# EAGLE design my (EAGLE 9.5.0)

## Sheet 1 of 2
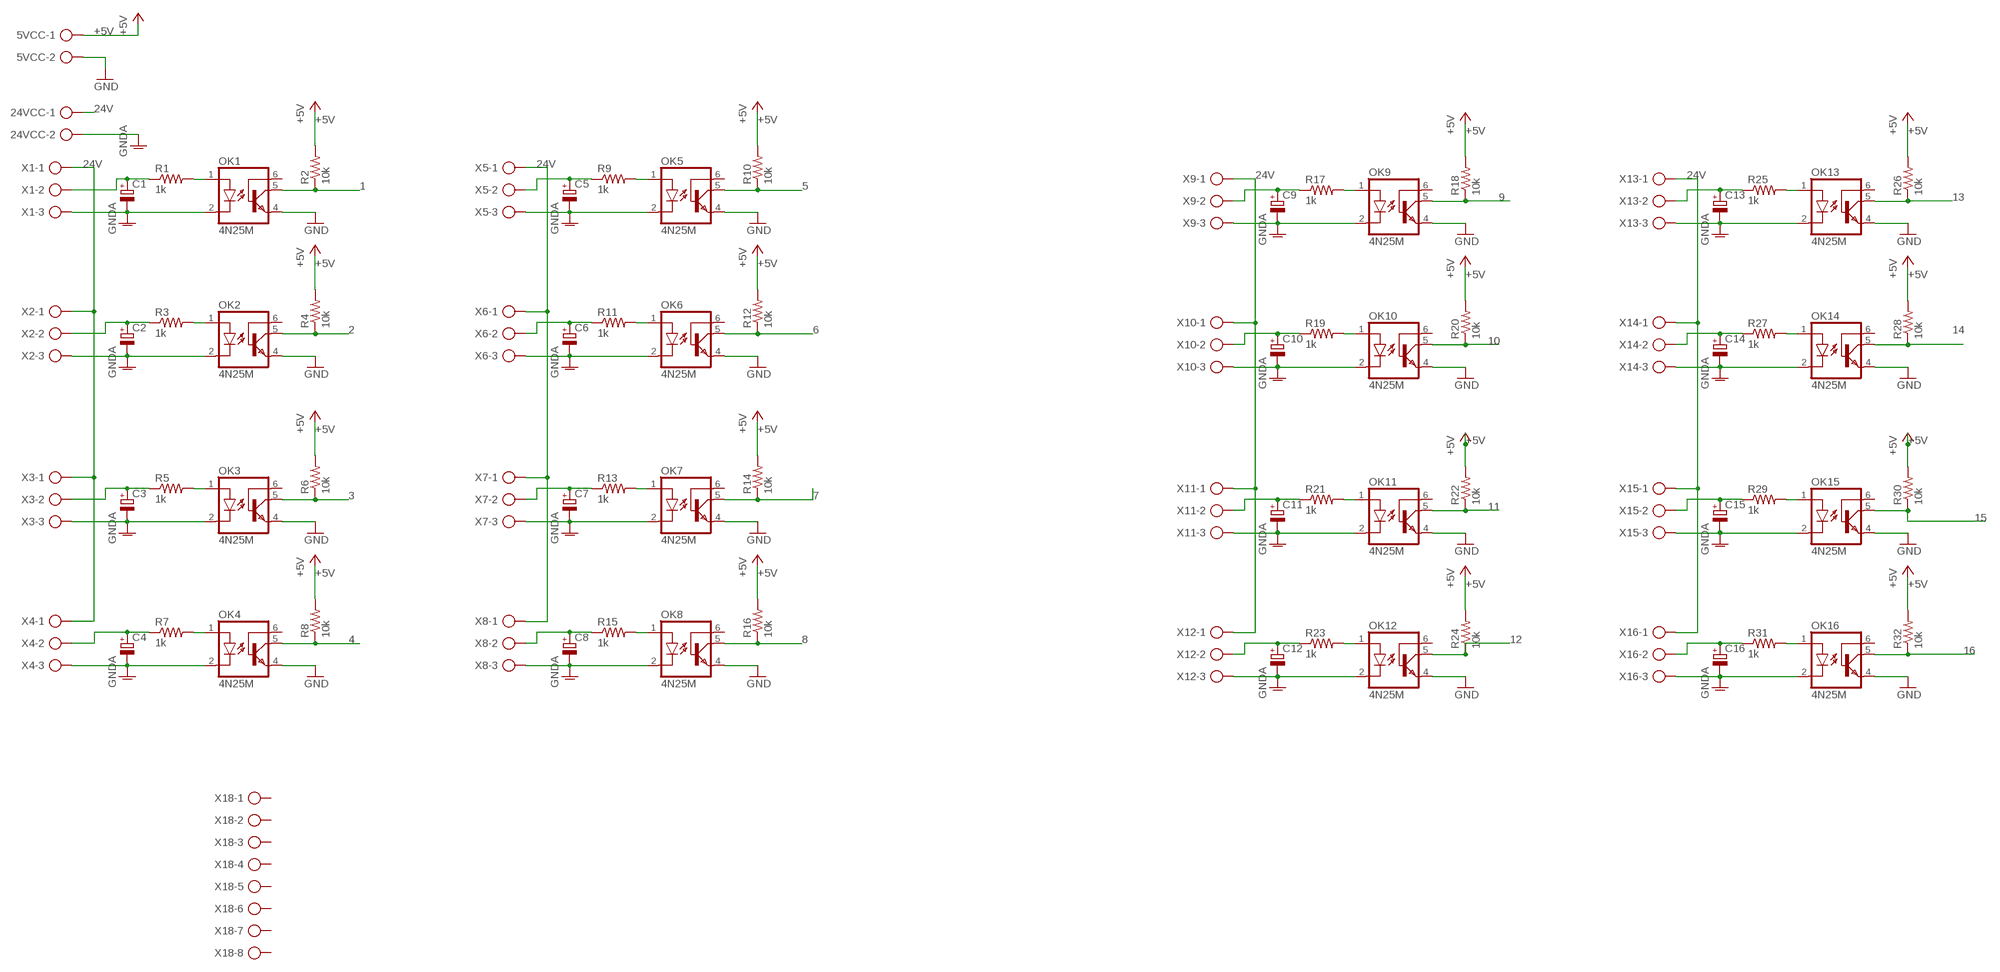
[diagram p0: schematic, sheet 1]

### Parts
5VCC  AK300/2  [AK300/2]
24VCC  AK300/2  [AK300/2]
C1  CPOL-EUE2.5-5  [E2,5-5]
C2  CPOL-EUE2.5-5  [E2,5-5]
C3  CPOL-EUE2.5-5  [E2,5-5]
C4  CPOL-EUE2.5-5  [E2,5-5]
C5  CPOL-EUE2.5-5  [E2,5-5]
C6  CPOL-EUE2.5-5  [E2,5-5]
C7  CPOL-EUE2.5-5  [E2,5-5]
C8  CPOL-EUE2.5-5  [E2,5-5]
C9  CPOL-EUE2.5-5  [E2,5-5]
C10  CPOL-EUE2.5-5  [E2,5-5]
C11  CPOL-EUE2.5-5  [E2,5-5]
C12  CPOL-EUE2.5-5  [E2,5-5]
C13  CPOL-EUE2.5-5  [E2,5-5]
C14  CPOL-EUE2.5-5  [E2,5-5]
C15  CPOL-EUE2.5-5  [E2,5-5]
C16  CPOL-EUE2.5-5  [E2,5-5]
OK1  4N25M  [DIL06]
OK2  4N25M  [DIL06]
OK3  4N25M  [DIL06]
OK4  4N25M  [DIL06]
OK5  4N25M  [DIL06]
OK6  4N25M  [DIL06]
OK7  4N25M  [DIL06]
OK8  4N25M  [DIL06]
OK9  4N25M  [DIL06]
OK10  4N25M  [DIL06]
OK11  4N25M  [DIL06]
OK12  4N25M  [DIL06]
OK13  4N25M  [DIL06]
OK14  4N25M  [DIL06]
OK15  4N25M  [DIL06]
OK16  4N25M  [DIL06]
R1  1k  R-US_0207/10  [0207/10]
R2  10k  R-US_0207/10  [0207/10]
R3  1k  R-US_0207/10  [0207/10]
R4  10k  R-US_0207/10  [0207/10]
R5  1k  R-US_0207/10  [0207/10]
R6  10k  R-US_0207/10  [0207/10]
R7  1k  R-US_0207/10  [0207/10]
R8  10k  R-US_0207/10  [0207/10]
R9  1k  R-US_0207/10  [0207/10]
R10  10k  R-US_0207/10  [0207/10]
R11  1k  R-US_0207/10  [0207/10]
R12  10k  R-US_0207/10  [0207/10]
R13  1k  R-US_0207/10  [0207/10]
R14  10k  R-US_0207/10  [0207/10]
R15  1k  R-US_0207/10  [0207/10]
R16  10k  R-US_0207/10  [0207/10]
R17  1k  R-US_0207/10  [0207/10]
R18  10k  R-US_0207/10  [0207/10]
R19  1k  R-US_0207/10  [0207/10]
R20  10k  R-US_0207/10  [0207/10]
R21  1k  R-US_0207/10  [0207/10]
R22  10k  R-US_0207/10  [0207/10]
R23  1k  R-US_0207/10  [0207/10]
R24  10k  R-US_0207/10  [0207/10]
R25  1k  R-US_0207/10  [0207/10]
R26  10k  R-US_0207/10  [0207/10]
R27  1k  R-US_0207/10  [0207/10]
R28  10k  R-US_0207/10  [0207/10]
R29  1k  R-US_0207/10  [0207/10]
R30  10k  R-US_0207/10  [0207/10]
R31  1k  R-US_0207/10  [0207/10]
R32  10k  R-US_0207/10  [0207/10]
X1  AK300/3  [AK300/3]
X2  AK300/3  [AK300/3]
X3  AK300/3  [AK300/3]
X4  AK300/3  [AK300/3]
X5  AK300/3  [AK300/3]
X6  AK300/3  [AK300/3]
X7  AK300/3  [AK300/3]
X8  AK300/3  [AK300/3]
X9  AK300/3  [AK300/3]
X10  AK300/3  [AK300/3]
X11  AK300/3  [AK300/3]
X12  AK300/3  [AK300/3]
X13  AK300/3  [AK300/3]
X14  AK300/3  [AK300/3]
X15  AK300/3  [AK300/3]
X16  AK300/3  [AK300/3]
X18  AK300/8  [AK300/8]

### Nets
1: OK1.5(COL) R2.1 ; also sheet 2
2: OK2.5(COL) R4.1 ; also sheet 2
3: OK3.5(COL) R6.1 ; also sheet 2
4: OK4.5(COL) R8.1 ; also sheet 2
5: OK5.5(COL) R10.1 ; also sheet 2
6: OK6.5(COL) R12.1 ; also sheet 2
7: OK7.5(COL) R14.1 ; also sheet 2
8: OK8.5(COL) R16.1 ; also sheet 2
9: OK9.5(COL) R18.1 ; also sheet 2
10: OK10.5(COL) R20.1 ; also sheet 2
11: OK11.5(COL) R22.1 ; also sheet 2
12: OK12.5(COL) R24.1 ; also sheet 2
13: OK13.5(COL) R26.1 ; also sheet 2
14: OK14.5(COL) R28.1 ; also sheet 2
15: OK15.5(COL) R30.1 ; also sheet 2
16: OK16.5(COL) R32.1 ; also sheet 2
24V: 24VCC.1 X1.1 X2.1 X3.1 X4.1 X5.1 X6.1 X7.1 X8.1 X9.1 X10.1 X11.1 X12.1 X13.1 X14.1 X15.1 X16.1
+5V: 5VCC.1 R2.2 R4.2 R6.2 R8.2 R10.2 R12.2 R14.2 R16.2 R18.2 R20.2 R22.2 R24.2 R26.2 R28.2 R30.2 R32.2 ; also sheet 2
GND: 5VCC.2 OK1.4(EMI) OK2.4(EMI) OK3.4(EMI) OK4.4(EMI) OK5.4(EMI) OK6.4(EMI) OK7.4(EMI) OK8.4(EMI) OK9.4(EMI) OK10.4(EMI) OK11.4(EMI) OK12.4(EMI) OK13.4(EMI) OK14.4(EMI) OK15.4(EMI) OK16.4(EMI) ; also sheet 2
GNDA: 24VCC.2 C1.- C2.- C3.- C4.- C5.- C6.- C7.- C8.- C9.- C10.- C11.- C12.- C13.- C14.- C15.- C16.- OK1.2(C) OK2.2(C) OK3.2(C) OK4.2(C) OK5.2(C) OK6.2(C) OK7.2(C) OK8.2(C) OK9.2(C) OK10.2(C) OK11.2(C) OK12.2(C) OK13.2(C) OK14.2(C) OK15.2(C) OK16.2(C) X1.3 X2.3 X3.3 X4.3 X5.3 X6.3 X7.3 X8.3 X9.3 X10.3 X11.3 X12.3 X13.3 X14.3 X15.3 X16.3
N$1: OK1.1(A) R1.2
N$2: OK2.1(A) R3.2
N$3: C2.+ R3.1 X2.2
N$5: OK3.1(A) R5.2
N$6: C3.+ R5.1 X3.2
N$8: OK4.1(A) R7.2
N$9: C4.+ R7.1 X4.2
N$11: OK5.1(A) R9.2
N$12: C5.+ R9.1 X5.2
N$14: OK6.1(A) R11.2
N$15: C1.+ R1.1 X1.2
N$16: C6.+ R11.1 X6.2
N$19: OK7.1(A) R13.2
N$20: C7.+ R13.1 X7.2
N$22: OK8.1(A) R15.2
N$23: C8.+ R15.1 X8.2
N$25: OK9.1(A) R17.2
N$26: C9.+ R17.1 X9.2
N$28: OK10.1(A) R19.2
N$29: C10.+ R19.1 X10.2
N$31: OK11.1(A) R21.2
N$32: C11.+ R21.1 X11.2
N$34: OK12.1(A) R23.2
N$35: C12.+ R23.1 X12.2
N$37: OK13.1(A) R25.2
N$38: C13.+ R25.1 X13.2
N$40: OK14.1(A) R27.2
N$41: C14.+ R27.1 X14.2
N$43: OK15.1(A) R29.2
N$44: C15.+ R29.1 X15.2
N$46: OK16.1(A) R31.2
N$47: C16.+ R31.1 X16.2
Unconnected: OK1.6(BAS) OK2.6(BAS) OK3.6(BAS) OK4.6(BAS) OK5.6(BAS) OK6.6(BAS) OK7.6(BAS) OK8.6(BAS) OK9.6(BAS) OK10.6(BAS) OK11.6(BAS) OK12.6(BAS) OK13.6(BAS) OK14.6(BAS) OK15.6(BAS) OK16.6(BAS) X18.1 X18.2 X18.3 X18.4 X18.5 X18.6 X18.7 X18.8

## Sheet 2 of 2
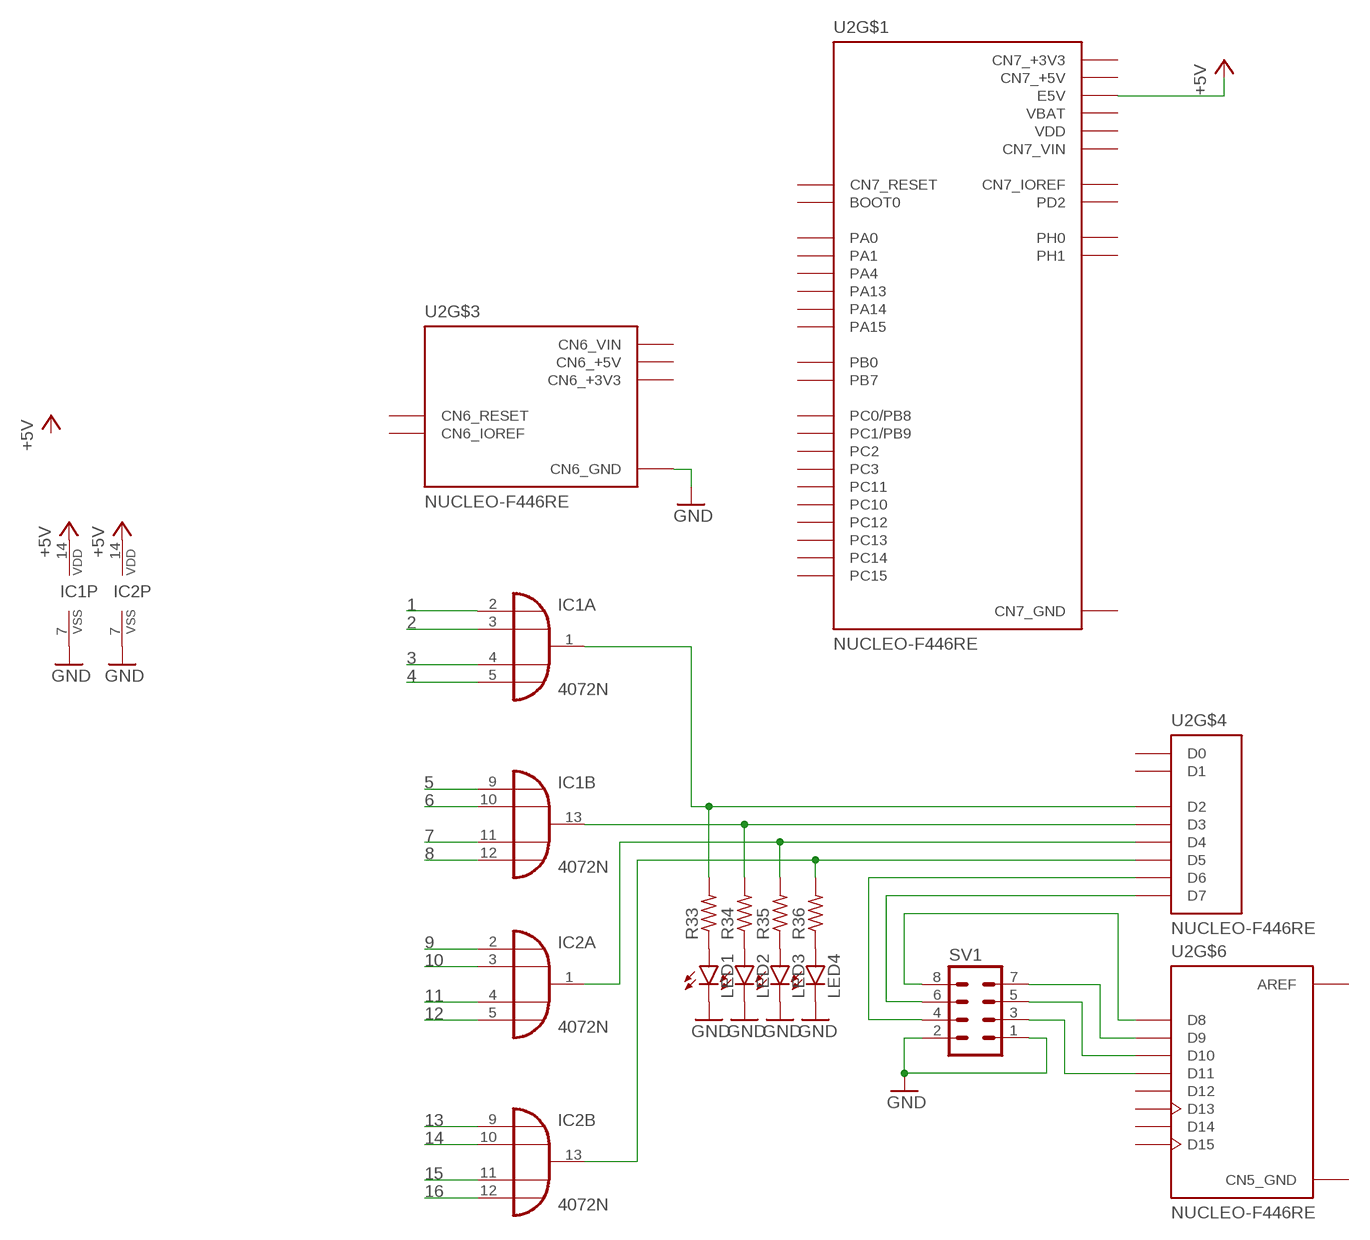
[diagram p1: schematic, sheet 2]

### Parts
IC1  4072N  [DIL14]
IC2  4072N  [DIL14]
LED1  LED3MM  [LED3MM]
LED2  LED3MM  [LED3MM]
LED3  LED3MM  [LED3MM]
LED4  LED3MM  [LED3MM]
R33  R-US_0207/10  [0207/10]
R34  R-US_0207/10  [0207/10]
R35  R-US_0207/10  [0207/10]
R36  R-US_0207/10  [0207/10]
SV1  MA04-2  [MA04-2]
U2  NUCLEO-F446RE  [MODULE_NUCLEO-F446RE]

### Nets
1: IC1.2(A:I0) ; also sheet 1
2: IC1.3(A:I1) ; also sheet 1
3: IC1.4(A:I2) ; also sheet 1
4: IC1.5(A:I3) ; also sheet 1
5: IC1.9(B:I0) ; also sheet 1
6: IC1.10(B:I1) ; also sheet 1
7: IC1.11(B:I2) ; also sheet 1
8: IC1.12(B:I3) ; also sheet 1
9: IC2.2(A:I0) ; also sheet 1
10: IC2.3(A:I1) ; also sheet 1
11: IC2.4(A:I2) ; also sheet 1
12: IC2.5(A:I3) ; also sheet 1
13: IC2.9(B:I0) ; also sheet 1
14: IC2.10(B:I1) ; also sheet 1
15: IC2.11(B:I2) ; also sheet 1
16: IC2.12(B:I3) ; also sheet 1
+5V: IC1.14(P:VDD) IC2.14(P:VDD) U2.CN7_6(E5V) ; also sheet 1
GND: IC1.7(P:VSS) IC2.7(P:VSS) LED1.K(C) LED2.K(C) LED3.K(C) LED4.K(C) SV1.1 SV1.2 U2.CN6_6(CN6_GND) U2.CN6_7(CN6_GND) ; also sheet 1
N$4: IC1.1(A:O) R33.2 U2.CN9_3(D2)
N$7: IC1.13(B:O) R34.2 U2.CN9_4(D3)
N$10: IC2.1(A:O) R35.2 U2.CN9_5(D4)
N$13: IC2.13(B:O) R36.2 U2.CN9_6(D5)
N$17: SV1.3 U2.CN5_4(D11)
N$18: SV1.4 U2.CN9_7(D6)
N$21: SV1.6 U2.CN9_8(D7)
N$24: SV1.8 U2.CN5_1(D8)
N$27: SV1.7 U2.CN5_2(D9)
N$30: SV1.5 U2.CN5_3(D10)
N$36: LED1.A R33.1
N$39: LED2.A R34.1
N$42: LED3.A R35.1
N$45: LED4.A R36.1
Unconnected: U2.CN5_5(D12) U2.CN5_6(D13) U2.CN5_9(D14) U2.CN5_10(D15) U2.CN6_2(CN6_IOREF) U2.CN6_3(CN6_RESET) U2.CN7_1(PC10) U2.CN7_2(PC11) U2.CN7_3(PC12) U2.CN7_4(PD2) U2.CN7_7(BOOT0) U2.CN7_12(CN7_IOREF) U2.CN7_13(PA13) U2.CN7_14(CN7_RESET) U2.CN7_15(PA14) U2.CN7_17(PA15) U2.CN7_21(PB7) U2.CN7_23(PC13) U2.CN7_25(PC14) U2.CN7_27(PC15) U2.CN7_28(PA0) U2.CN7_29(PH0) U2.CN7_30(PA1) U2.CN7_31(PH1) U2.CN7_32(PA4) U2.CN7_34(PB0) U2.CN7_35(PC2) U2.CN7_36(PC1/PB9) U2.CN7_37(PC3) U2.CN7_38(PC0/PB8) U2.CN8_1(A0) U2.CN8_2(A1) U2.CN8_3(A2) U2.CN8_4(A3) U2.CN8_5(A4) U2.CN8_6(A5) U2.CN9_1(D0) U2.CN9_2(D1) U2.CN10_1(PC9) U2.CN10_2(PC8) U2.CN10_3(PB8) U2.CN10_4(PC6) U2.CN10_5(PB9) U2.CN10_6(PC5) U2.CN10_11(PA5) U2.CN10_12(PA12) U2.CN10_13(PA6) U2.CN10_14(PA11) U2.CN10_15(PA7) U2.CN10_16(PB12) U2.CN10_17(PB6) U2.CN10_19(PC7) U2.CN10_21(PA9) U2.CN10_22(PB2) U2.CN10_23(PA8) U2.CN10_24(PB1) U2.CN10_25(PB10) U2.CN10_26(PB15) U2.CN10_27(PB4) U2.CN10_28(PB14) U2.CN10_29(PB5) U2.CN10_30(PB13) U2.CN10_31(PB3) U2.CN10_33(PA10) U2.CN10_34(PC4) U2.CN10_35(PA2) U2.CN10_37(PA3)

## Power pins joined to a net without a drawn wire
AGND: U2.CN10_32(AGND)
AREF: U2.CN5_8(AREF)
AVDD: U2.CN10_7(AVDD)
CN5_GND: U2.CN5_7(CN5_GND)
CN6_+3V3: U2.CN6_4(CN6_+3V3)
CN6_+5V: U2.CN6_5(CN6_+5V)
CN6_VIN: U2.CN6_8(CN6_VIN)
CN7_+3V3: U2.CN7_16(CN7_+3V3)
CN7_+5V: U2.CN7_18(CN7_+5V)
CN7_GND: U2.CN7_8(CN7_GND) U2.CN7_19(CN7_GND) U2.CN7_20(CN7_GND) U2.CN7_22(CN7_GND)
CN7_VIN: U2.CN7_24(CN7_VIN)
CN10_GND: U2.CN10_9(CN10_GND) U2.CN10_20(CN10_GND)
U5V: U2.CN10_8(U5V)
VBAT: U2.CN7_33(VBAT)
VDD: U2.CN7_5(VDD)

## Library data of the parts
5VCC 24VCC = con-ptr500:AK300/2: CONNECTOR; OC_FARNELL: unknown; OC_NEWARK: unknown
C1-C16 = rcl:CPOL-EU: POLARIZED CAPACITOR, European symbol; SPICEPREFIX: C
IC1 IC2 = 40xx:4072: Dual 4-input OR
LED1-LED4 = led:LED: LED OSRAM: - CHIPLED LG R971, LG N971, LY N971, LG Q971, LY Q971, LO R971, LY R971 LH N974, LH R974 LS Q976, LO Q976, LY Q976 LO Q996 - Hyper CHIPLED LW Q18S LB Q993, LB Q99A, LB R99A - SideLED LS A670, LO A670, LY A670, LG A670, LP A670 LB A673, LV A673, LT A673, LW A673 LH A674 LY A675 LS A676, LA A676, LO A676, LY A676, LW A676 LS A679, LY A679, LG A679 - Hyper Micro SIDELED® LS Y876, LA Y876, LO Y876, LY Y876 LT Y87S - SmartLED LW L88C, LW L88S LB L89C, LB L89S, LG L890 LS L89K, LO L89K, LY L89K LS L896, LA L896, LO L896, LY L896 - TOPLED LS T670, LO T670, LY T670, LG T670, LP T670 LSG T670, LSP T670, LSY T670, LOP T670, LYG T670 LG T671, LOG T671, LSG T671 LB T673, LV T673, LT T673, LW T673 LH T674 LS T676, LA T676, LO T676, LY T676, LB T676, LH T676, LSB T676, LW T676 LB T67C, LV T67C, LT T67C, LS T67K, LO T67K, LY T67K, LW E67C LS E67B, LA E67B, LO E67B, LY E67B, LB E67C, LV E67C, LT E67C LW T67C LS T679, LY T679, LG T679 LS T770, LO T770, LY T770, LG T770, LP T770 LB T773, LV T773, LT T773, LW T773 LH T774 LS E675, LA E675, LY E675, LS T675 LS T776, LA T776, LO T776, LY T776, LB T776 LHGB T686 LT T68C, LB T68C - Hyper Mini TOPLED® LB M676 - Mini TOPLED Santana® LG M470 LS M47K, LO M47K, LY M47K Source: http://www.osram.convergy.de LUXEON: - LUMILED® LXK2-PW12-R00, LXK2-PW12-S00, LXK2-PW14-U00, LXK2-PW14-V00 LXK2-PM12-R00, LXK2-PM12-S00, LXK2-PM14-U00 LXK2-PE12-Q00, LXK2-PE12-R00, LXK2-PE12-S00, LXK2-PE14-T00, LXK2-PE14-U00 LXK2-PB12-K00, LXK2-PB12-L00, LXK2-PB12-M00, LXK2-PB14-N00, LXK2-PB14-P00, LXK2-PB14-Q00 LXK2-PR12-L00, LXK2-PR12-M00, LXK2-PR14-Q00, LXK2-PR14-R00 LXK2-PD12-Q00, LXK2-PD12-R00, LXK2-PD12-S00 LXK2-PH12-R00, LXK2-PH12-S00 LXK2-PL12-P00, LXK2-PL12-Q00, LXK2-PL12-R00 Source: www.luxeon.com KINGBRIGHT: KA-3528ASYC Source: www.kingbright.com
OK1-OK16 = optocoupler:4N*?M: General Purpose 6-Pin Phototransistor Optocouplers Source: http://www.fairchildsemi.com/ds/4N/4N35-M.pdf; MPN: 4N25-M; OC_FARNELL: 1021349; OC_NEWARK: 98K9084
R1-R36 = rcl:R-US_: RESISTOR, American symbol; SPICEPREFIX: R
SV1 = con-lstb:MA04-2: PIN HEADER; OC_FARNELL: unknown; OC_NEWARK: unknown
U2 = NUCLEO-F446RE:NUCLEO-F446RE: STM32 Nucleo-64 development board with STM32F446RET6 MCU, supports Arduino and ST morpho connectivity Check prices <https://pricing.snapeda.com/parts/NUCLEO-F446RE/STMicroelectronics/view-part?ref=eda>; AVAILABILITY: Warning; DESCRIPTION: STM32F446RE, mbed-Enabled Development Nucleo-64 STM32F4 ARM® Cortex®-M4 MCU 32-Bit Embedded Evaluation Board; MF: STMicroelectronics; MP: NUCLEO-F446RE; PACKAGE: None; PRICE: None; PURCHASE-URL: https://pricing.snapeda.com/search/part/NUCLEO-F446RE/?ref=eda
X1-X16 = con-ptr500:AK300/3: CONNECTOR; OC_FARNELL: unknown; OC_NEWARK: unknown
X18 = con-ptr500:AK300/8: CONNECTOR; OC_FARNELL: unknown; OC_NEWARK: unknown

## Board
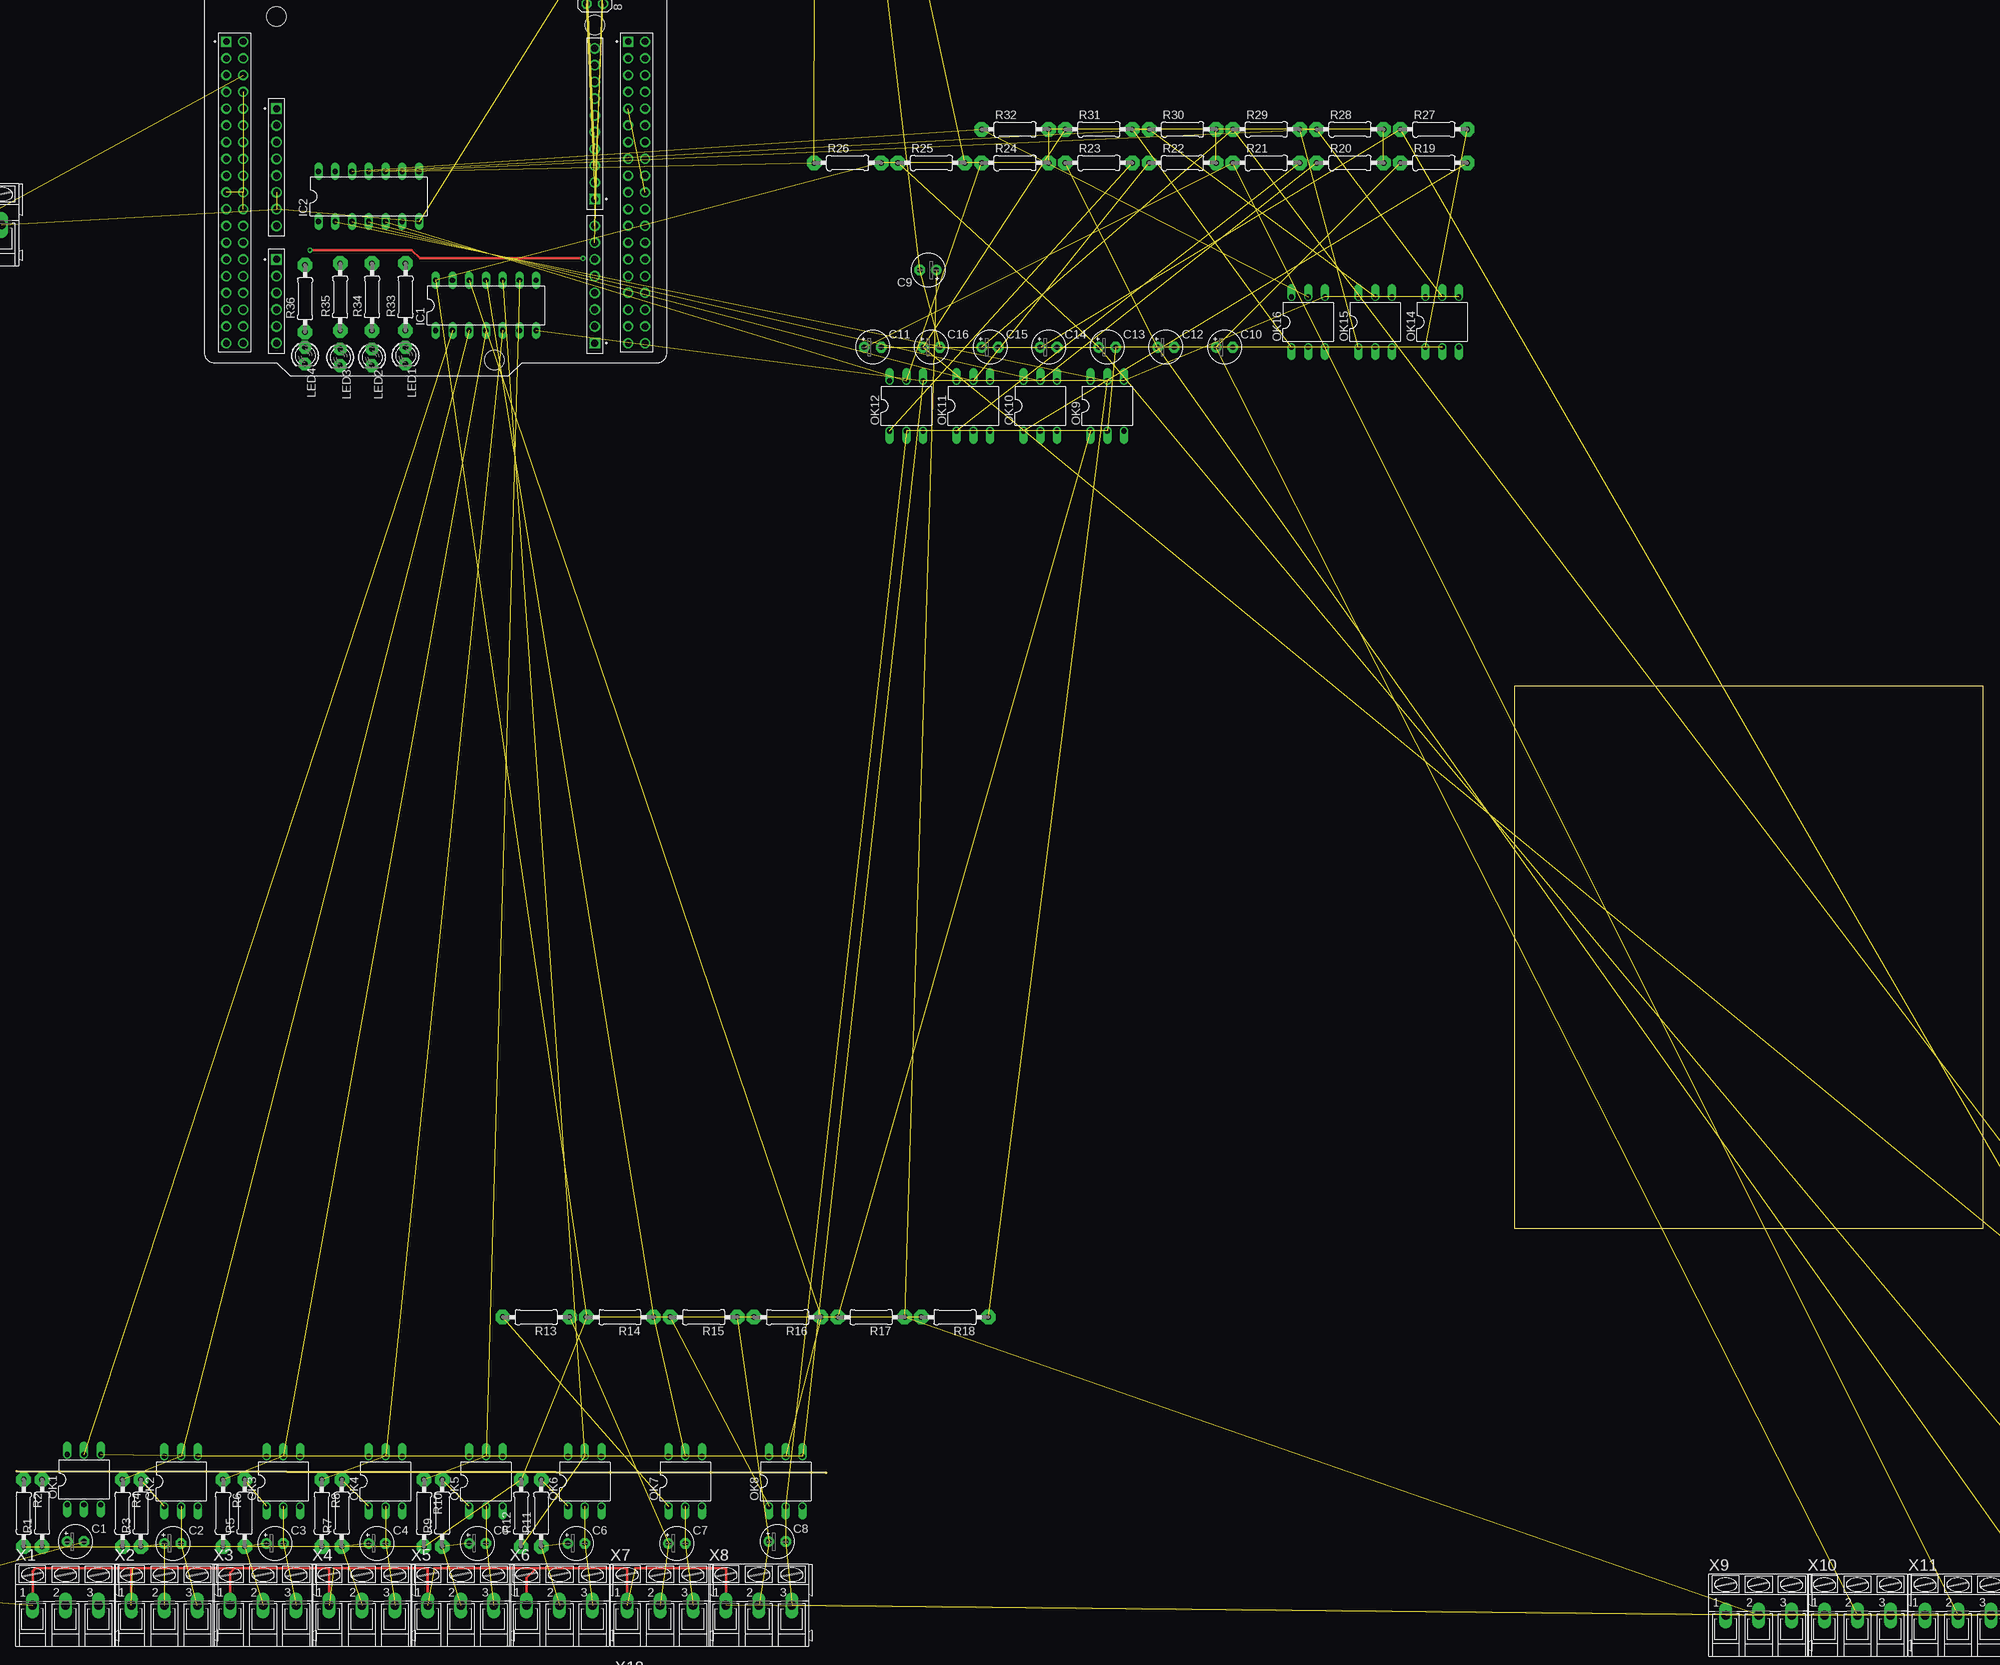
[diagram p2: board, top side]
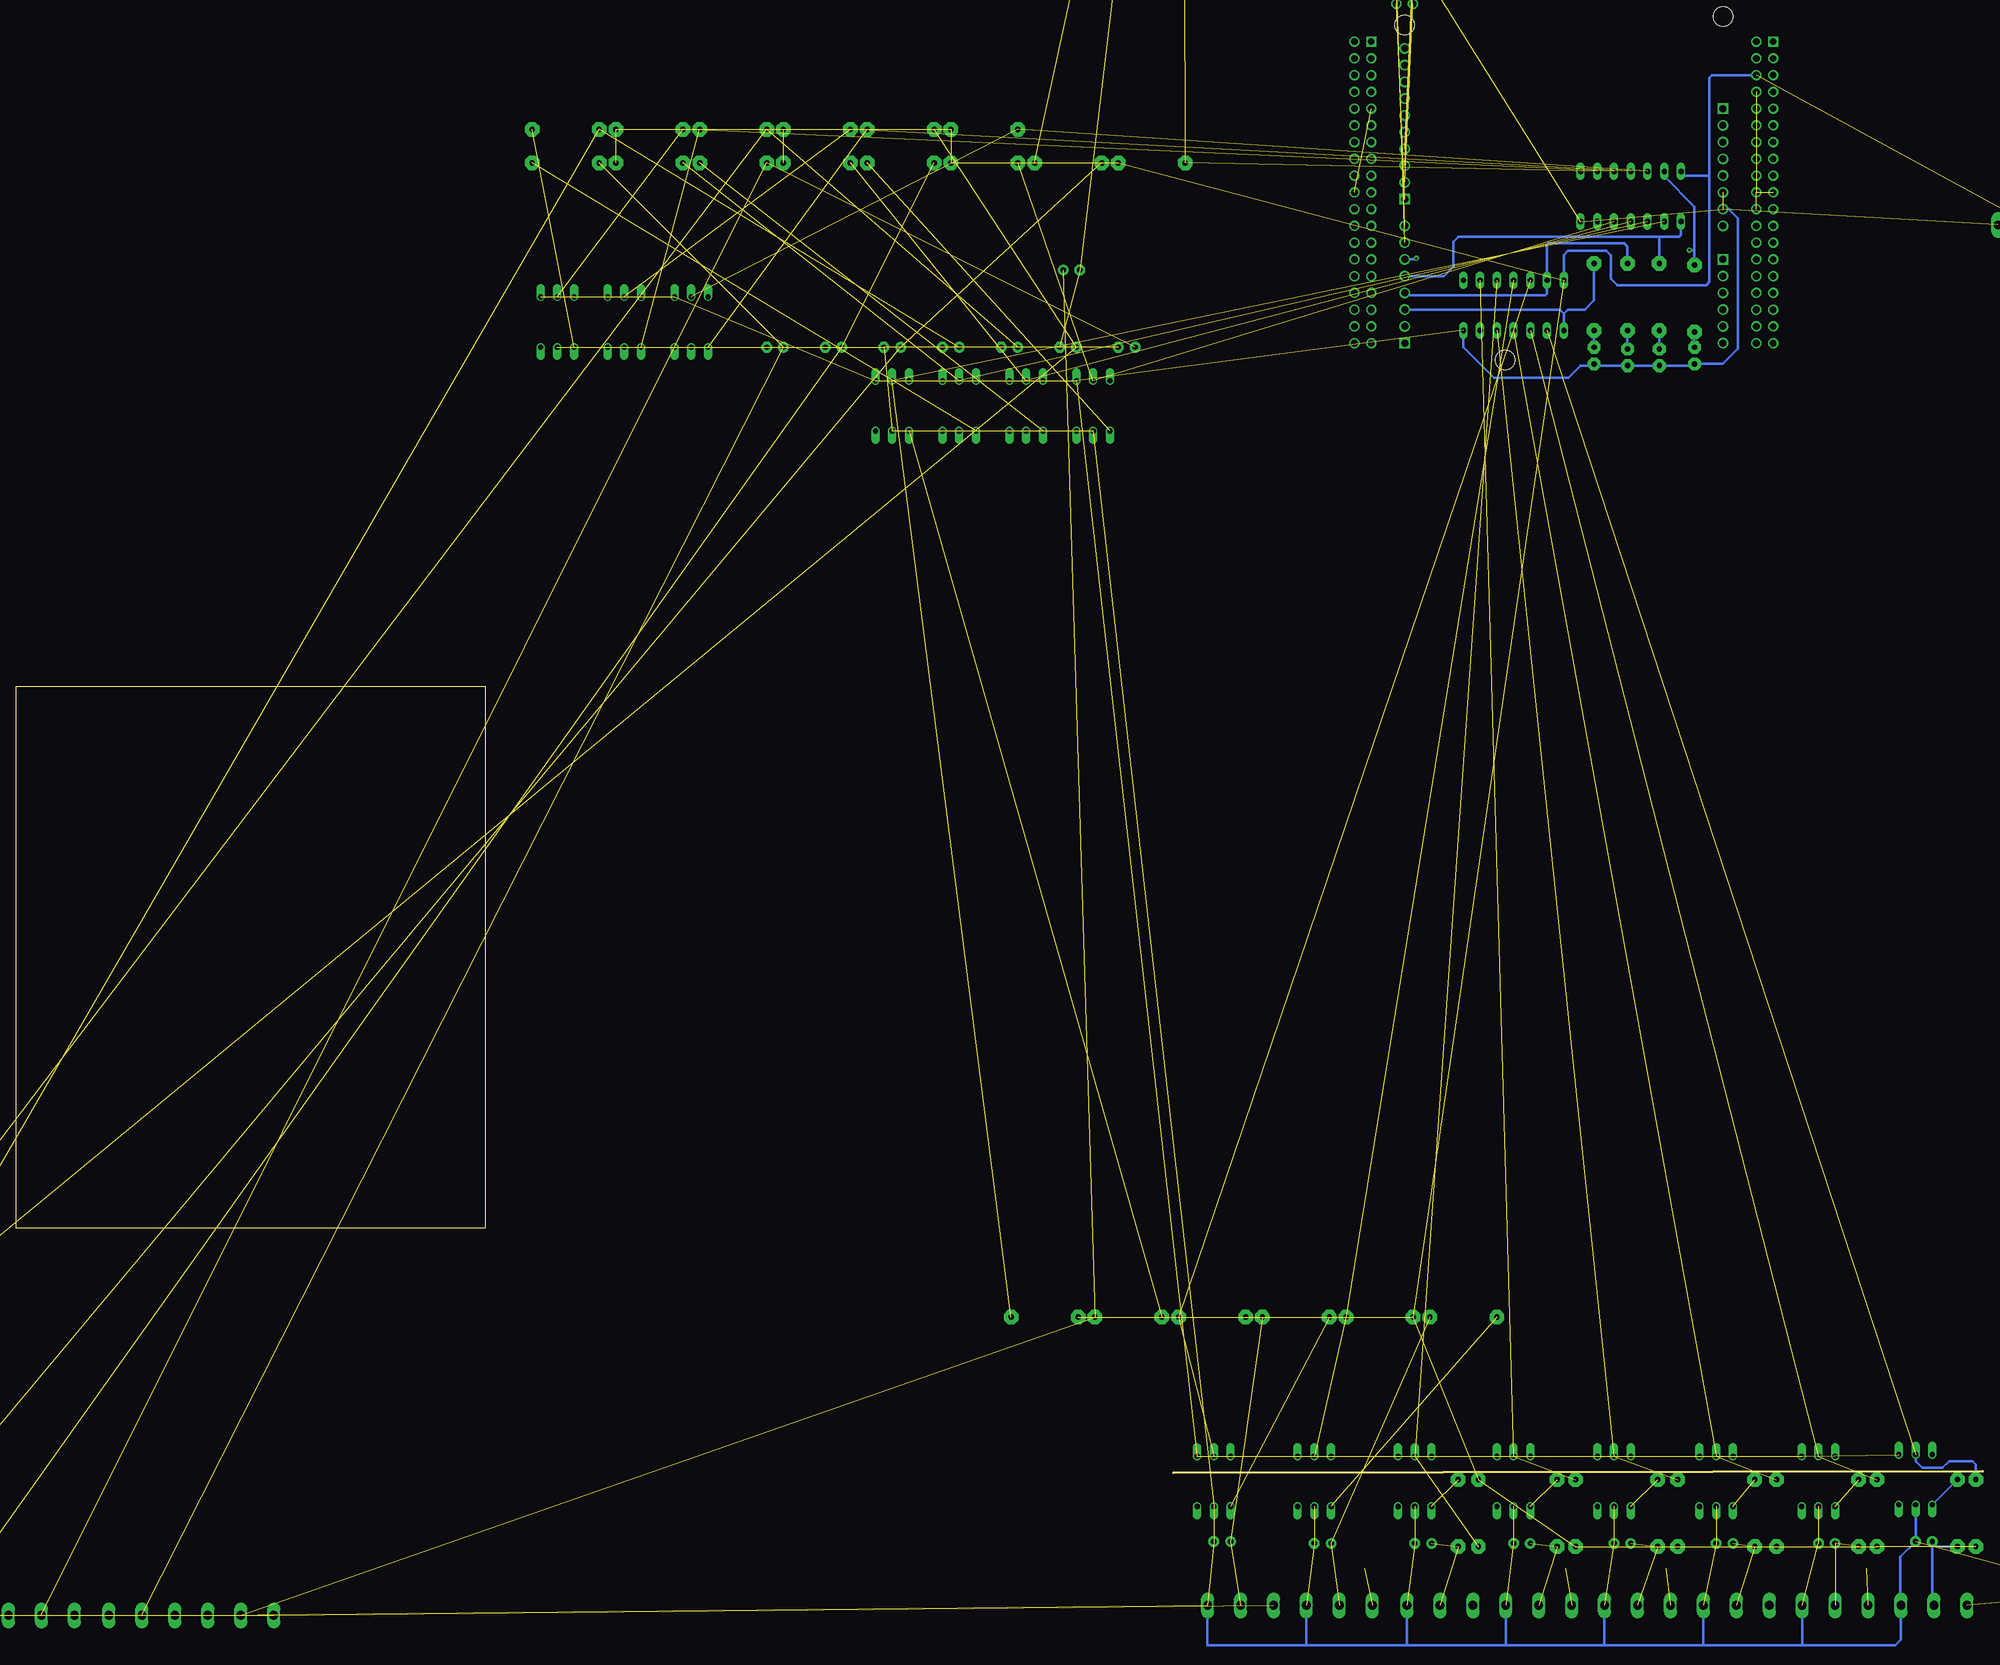
[diagram p3: board, bottom side, seen from below]

Size 298.18 x 119.3 mm. Coordinates in mm from the lower left corner, seen from the top.
Outline: 0,0.25 122.68,0
Outline: 227.08,37.08 298.18,37.08 298.18,119.3 227.08,119.3 227.08,37.08
Copper layers (1*16): Top 0.035mm / dielectric 1.5mm / Bottom 0.035mm
Design rules "default *": minimum track width 16mil, minimum drill 0.35mm, track to track 24mil, track to pad 24mil, pad to pad 24mil, via to via 24mil, smd to smd 24mil, copper to edge 0mil, drill to drill 6mil, minimum pad ring 10mil, minimum via ring 8mil, stop-mask expansion 4mil, vias tented up to drill 0mil, thermal gap 10mil

### Footprints (pad centres in the part's own frame; a part is rotated, then mirrored left to right if it is on the bottom)
AK300/2 = drill 1.321 long: 1 -2.515,0; 2 2.489,0
E2,5-5 = drill 0.813 pad 1.6: + -1.27,0 | drill 0.813 pad 1.6 octagon: - 1.27,0
DIL14 = drill 0.813 long: 1 -7.62,-3.81; 2 -5.08,-3.81; 3 -2.54,-3.81; 4 0,-3.81; 5 2.54,-3.81; 6 5.08,-3.81; 7 7.62,-3.81; 8 7.62,3.81; 9 5.08,3.81; 10 2.54,3.81; 11 0,3.81; 12 -2.54,3.81; 13 -5.08,3.81; 14 -7.62,3.81
LED3MM = drill 0.813 pad 1.93 octagon: A -1.27,0; K 1.27,0
DIL06 = drill 0.813 offset: 1 -2.54,-3.81; 2 0,-3.81; 3 2.54,-3.81; 4 2.54,3.81; 5 0,3.81; 6 -2.54,3.81
0207/10 = drill 0.813 pad 2.184 octagon: 1 -5.08,0; 2 5.08,0
MA04-2 = drill 1.016 octagon: 1 -3.81,-1.27; 2 -3.81,1.27; 3 -1.27,-1.27; 4 -1.27,1.27; 5 1.27,-1.27; 6 1.27,1.27; 7 3.81,-1.27; 8 3.81,1.27
MODULE_NUCLEO-F446RE = drill 1.07 square: CN5_1 24.13,-14.37; CN6_1 -24.13,-0.65; CN8_1 -24.13,-23.51; CN9_1 24.13,-36.21 | drill 1.07: CN5_2 24.13,-11.83; CN5_3 24.13,-9.29; CN5_4 24.13,-6.75; CN5_5 24.13,-4.21; CN5_6 24.13,-1.67; CN5_7 24.13,0.87; CN5_8 24.13,3.41; CN5_9 24.13,5.95; CN5_10 24.13,8.49; CN6_2 -24.13,-3.19; CN6_3 -24.13,-5.73; CN6_4 -24.13,-8.27; CN6_5 -24.13,-10.81; CN6_6 -24.13,-13.35; CN6_7 -24.13,-15.89; CN6_8 -24.13,-18.43; CN8_2 -24.13,-26.05; CN8_3 -24.13,-28.59; CN8_4 -24.13,-31.13; CN8_5 -24.13,-33.67; CN8_6 -24.13,-36.21; CN9_2 24.13,-33.67; CN9_3 24.13,-31.13; CN9_4 24.13,-28.59; CN9_5 24.13,-26.05; CN9_6 24.13,-23.51; CN9_7 24.13,-20.97; CN9_8 24.13,-18.43 | drill 1.02 square: CN7_1 -31.75,9.51; CN10_1 29.21,9.51 | drill 1.02: CN7_2 -29.21,9.51; CN7_3 -31.75,6.97; CN7_4 -29.21,6.97; CN7_5 -31.75,4.43; CN7_6 -29.21,4.43; CN7_7 -31.75,1.89; CN7_8 -29.21,1.89; CN7_9 -31.75,-0.65; CN7_10 -29.21,-0.65; CN7_11 -31.75,-3.19; CN7_12 -29.21,-3.19; CN7_13 -31.75,-5.73; CN7_14 -29.21,-5.73; CN7_15 -31.75,-8.27; CN7_16 -29.21,-8.27; CN7_17 -31.75,-10.81; CN7_18 -29.21,-10.81; CN7_19 -31.75,-13.35; CN7_20 -29.21,-13.35; CN7_21 -31.75,-15.89; CN7_22 -29.21,-15.89; CN7_23 -31.75,-18.43; CN7_24 -29.21,-18.43; CN7_25 -31.75,-20.97; CN7_26 -29.21,-20.97; CN7_27 -31.75,-23.51; CN7_28 -29.21,-23.51; CN7_29 -31.75,-26.05; CN7_30 -29.21,-26.05; CN7_31 -31.75,-28.59; CN7_32 -29.21,-28.59; CN7_33 -31.75,-31.13; CN7_34 -29.21,-31.13; CN7_35 -31.75,-33.67; CN7_36 -29.21,-33.67; CN7_37 -31.75,-36.21; CN7_38 -29.21,-36.21; CN10_2 31.75,9.51; CN10_3 29.21,6.97; CN10_4 31.75,6.97; CN10_5 29.21,4.43; CN10_6 31.75,4.43; CN10_7 29.21,1.89; CN10_8 31.75,1.89; CN10_9 29.21,-0.65; CN10_10 31.75,-0.65; CN10_11 29.21,-3.19; CN10_12 31.75,-3.19; CN10_13 29.21,-5.73; CN10_14 31.75,-5.73; CN10_15 29.21,-8.27; CN10_16 31.75,-8.27; CN10_17 29.21,-10.81; CN10_18 31.75,-10.81; CN10_19 29.21,-13.35; CN10_20 31.75,-13.35; CN10_21 29.21,-15.89; CN10_22 31.75,-15.89; CN10_23 29.21,-18.43; CN10_24 31.75,-18.43; CN10_25 29.21,-20.97; CN10_26 31.75,-20.97; CN10_27 29.21,-23.51; CN10_28 31.75,-23.51; CN10_29 29.21,-26.05; CN10_30 31.75,-26.05; CN10_31 29.21,-28.59; CN10_32 31.75,-28.59; CN10_33 29.21,-31.13; CN10_34 31.75,-31.13; CN10_35 29.21,-33.67; CN10_36 31.75,-33.67; CN10_37 29.21,-36.21; CN10_38 31.75,-36.21 | hole 3: 8.89,-38.75; 24.13,12.05; -24.13,13.32
AK300/3 = drill 1.321 long: 1 -5.004,0; 2 0,0; 3 5.004,0
AK300/8 = drill 1.321 long: 1 -17.501,0; 2 -12.497,0; 3 -7.518,0; 4 -2.515,0; 5 2.515,0; 6 7.518,0; 7 12.497,0; 8 17.501,0

### Placement (x,y rotation side)
5VCC  -4.83,189.23 0 top  (outside the outline)
24VCC  -19.81,-18.03 0 top  (outside the outline)
C1  8.89,-10.41 0 top  (outside the outline)
C2  23.62,-10.67 0 top  (outside the outline)
C3  39.12,-10.67 0 top  (outside the outline)
C4  54.61,-10.67 0 top  (outside the outline)
C5  69.85,-10.67 0 top  (outside the outline)
C6  84.84,-10.67 0 top  (outside the outline)
C7  100.08,-10.67 0 top  (outside the outline)
C8  115.32,-10.41 0 top  (outside the outline)
C9  138.18,182.37 180 top  (outside the outline)
C10  183.13,170.69 0 top  (outside the outline)
C11  129.79,170.69 0 top  (outside the outline)
C12  174.24,170.69 0 top  (outside the outline)
C13  165.35,170.69 0 top  (outside the outline)
C14  156.46,170.69 0 top  (outside the outline)
C15  147.57,170.69 0 top  (outside the outline)
C16  138.68,170.69 0 top  (outside the outline)
IC1  71.12,177.04 0 top  (outside the outline)
IC2  53.34,193.55 0 top  (outside the outline)
LED1  58.93,169.42 270 top  (outside the outline)
LED2  53.85,169.16 270 top  (outside the outline)
LED3  49.02,169.16 270 top  (outside the outline)
LED4  43.69,169.42 270 top  (outside the outline)
OK1  10.16,-1.02 0 top
OK2  24.89,-1.27 0 top
OK3  40.39,-1.27 0 top
OK4  55.88,-1.27 0 top
OK5  71.12,-1.27 0 top
OK6  86.11,-1.27 0 top
OK7  101.35,-1.27 0 top
OK8  116.59,-1.27 0 top
OK9  165.35,161.8 0 top  (outside the outline)
OK10  155.19,161.8 0 top  (outside the outline)
OK11  145.03,161.8 0 top  (outside the outline)
OK12  134.87,161.8 0 top  (outside the outline)
OK13  121.16,318.26 0 top  (outside the outline)
OK14  216.15,174.5 0 top  (outside the outline)
OK15  205.99,174.5 0 top  (outside the outline)
OK16  195.83,174.5 0 top  (outside the outline)
R1  3.81,-6.1 90 top
R2  1.02,-6.1 270 top
R3  18.8,-6.1 90 top
R4  16,-6.1 270 top
R5  34.54,-6.1 90 top
R6  31.24,-6.1 270 top
R7  49.28,-6.1 90 top
R8  46.23,-6.1 270 top
R9  64.52,-6.1 90 top
R10  61.72,-6.1 270 top
R11  79.5,-6.1 90 top
R12  76.45,-6.1 90 top
R13  78.74,23.62 180 top
R14  91.44,23.62 180 top
R15  104.14,23.62 180 top
R16  116.84,23.62 180 top
R17  129.54,23.62 180 top
R18  142.24,23.62 180 top
R19  214.88,198.63 0 top  (outside the outline)
R20  202.18,198.63 0 top  (outside the outline)
R21  189.48,198.63 0 top  (outside the outline)
R22  176.78,198.63 0 top  (outside the outline)
R23  164.08,198.63 0 top  (outside the outline)
R24  151.38,198.63 0 top  (outside the outline)
R25  138.68,198.63 0 top  (outside the outline)
R26  125.98,198.63 0 top  (outside the outline)
R27  214.88,203.71 0 top  (outside the outline)
R28  202.18,203.71 0 top  (outside the outline)
R29  189.48,203.71 0 top  (outside the outline)
R30  176.78,203.71 0 top  (outside the outline)
R31  164.08,203.71 0 top  (outside the outline)
R32  151.38,203.71 0 top  (outside the outline)
R33  58.93,178.31 90 top  (outside the outline)
R34  53.85,178.31 90 top  (outside the outline)
R35  49.02,178.31 90 top  (outside the outline)
R36  43.69,178.05 90 top  (outside the outline)
SV1  87.63,226.57 270 top  (outside the outline)
U2  63.5,207.52 0 top  (outside the outline)
X1  7.37,-20.07 0 top  (outside the outline)
X2  22.35,-20.07 0 top  (outside the outline)
X3  37.34,-20.07 0 top  (outside the outline)
X4  52.32,-20.07 0 top  (outside the outline)
X5  67.31,-20.07 0 top  (outside the outline)
X6  82.3,-20.07 0 top  (outside the outline)
X7  97.54,-20.07 0 top  (outside the outline)
X8  112.52,-20.07 0 top  (outside the outline)
X9  264.16,-21.59 0 top  (outside the outline)
X10  279.15,-21.59 0 top  (outside the outline)
X11  294.39,-21.59 0 top  (outside the outline)
X12  309.63,-21.59 0 top  (outside the outline)
X13  324.87,-21.59 0 top  (outside the outline)
X14  340.11,-21.59 0 top  (outside the outline)
X15  355.35,-21.59 0 top  (outside the outline)
X16  370.59,-21.59 0 top  (outside the outline)
X18  110.74,-37.08 0 top  (outside the outline)

### Tracks (layer width: path | path; a pad name or v marks a point on that pad's centre or on a via)
1  (1 unrouted)
  Bottom 0.406: R2.1 1.02,1.27 1.52,1.78 5.08,1.78 6.1,0.76 9.14,0.76 10.16,1.78 OK1.5
2  (2 unrouted)
3  (2 unrouted)
4  (2 unrouted)
5  (2 unrouted)
6  (2 unrouted)
7  (2 unrouted)
8  (2 unrouted)
9  (2 unrouted)
10  (2 unrouted)
11  (2 unrouted)
12  (2 unrouted)
13  (2 unrouted)
14  (2 unrouted)
15  (2 unrouted)
16  (2 unrouted)
24V  (13 unrouted)
  Top 0.406: X1.1 2.36,-14.91 2.79,-14.48 17.35,-14.48 X2.1 | 17.53,-14.48 33.02,-14.48 | 33.02,-14.48 47.32,-14.48 X4.1 | 48.01,-14.48 62.31,-14.48 X5.1 | 63.25,-14.48 78.74,-14.48 | 78.74,-14.48 92.53,-14.48 X7.1 | 93.73,-14.48 107.52,-14.48 X8.1 | X6.1 77.29,-15.93 78.74,-14.48 | X3.1 32.33,-15.16 33.02,-14.48
+5V  (17 unrouted)
  Bottom 0.406: 41.4,196.71 45.07,196.71 IC2.14 | 41.4,196.71 41.4,180.59 41.91,180.09 55.37,180.09 56.39,181.1 56.39,184.66 57.02,185.29 62.86,185.29 63.5,184.66 IC1.14 | U2.CN7_6 41.04,211.95 41.4,211.58 41.4,196.71
CN7_GND  (3 unrouted)
CN10_GND  (1 unrouted)
GND  (21 unrouted)
  Bottom 0.406: OK1.4 12.7,3.05 | IC1.7 78.74,170.69 74.1,166.05 62.8,166.05 60.96,167.89 58.93,167.89 LED1.K 58.67,167.89 LED2.K 53.59,167.64 53.34,167.89 LED3.K 43.94,167.89 LED4.K 39.37,168.15 37.08,170.43 37.08,190.25 38.47,191.63 U2.CN6_7
GNDA  (39 unrouted)
  Bottom 0.406: X1.3 12.37,-20.83 | 12.37,-20.83 12.37,-25.32 13.21,-26.16 27.36,-26.16 | 27.36,-26.16 42.34,-26.16 | 42.34,-26.16 57.33,-26.16 | 57.33,-26.16 72.31,-26.16 | 72.31,-26.16 87.3,-26.16 | 87.3,-26.16 102.54,-26.16 | 102.54,-26.16 117.53,-26.16 X8.3 | X7.3 102.54,-26.16 | X6.3 87.3,-26.16 | X4.3 57.33,-26.16 | X5.3 72.31,-26.16 | X2.3 27.36,-26.16 | X3.3 42.34,-26.16 | 12.37,-20.83 12.45,-20.75 12.45,-12.7 C1.- OK1.2
N$1
  Bottom 0.406: OK1.1 R1.2
N$2  (1 unrouted)
N$3  (2 unrouted)
N$4
  Bottom 0.406: R33.2 58.93,177.8 60.32,176.4 62.86,176.4 63.5,175.77 | 63.5,175.77 IC1.1 | U2.CN9_3 64.12,176.39 63.5,175.77
N$5  (1 unrouted)
N$6  (2 unrouted)
N$7
  Bottom 0.406: R34.2 53.85,185.93 54.36,186.44 65.79,186.44 66.04,186.18 IC1.13 66.04,178.82 66.29,178.56 87.26,178.56 U2.CN9_4
N$8  (1 unrouted)
N$9  (2 unrouted)
N$10
  Bottom 0.406: 49.02,187.45 45.97,187.45 45.72,187.71 IC2.1 | 49.02,187.45 R35.2 | U2.CN9_5 81.68,181.47 80.26,182.88 80.26,186.69 79.5,187.45 49.02,187.45
N$11  (1 unrouted)
N$12  (2 unrouted)
N$13  (via drill 0.35)
  Top 0.406: v85.85,184.15 61.11,184.15 59.84,185.42 v44.45,185.42
  Bottom 0.406: IC2.13 48.26,196.6 43.69,192.02 43.69,185.42 | 43.69,185.42 R36.2 | U2.CN9_6 85.99,184.01 v85.85,184.15 | v44.45,185.42 43.69,185.42
N$14  (1 unrouted)
N$15
  Bottom 0.406: R1.1 6.86,-11.18 C1.+ 7.62,-19.81 X1.2
N$16  (2 unrouted)
N$17  (1 unrouted)
N$18  (1 unrouted)
N$19  (1 unrouted)
N$20  (2 unrouted)
N$21  (1 unrouted)
N$22  (1 unrouted)
N$23  (2 unrouted)
N$24  (1 unrouted)
N$25  (1 unrouted)
N$26  (2 unrouted)
N$27  (1 unrouted)
N$28  (1 unrouted)
N$29  (2 unrouted)
N$30  (1 unrouted)
N$31  (1 unrouted)
N$32  (2 unrouted)
N$34  (1 unrouted)
N$35  (2 unrouted)
N$36
  Bottom 0.406: R33.1 LED1.A
N$37  (1 unrouted)
N$38  (2 unrouted)
N$39
  Bottom 0.406: R34.1 LED2.A
N$40  (1 unrouted)
N$41  (2 unrouted)
N$42
  Bottom 0.406: R35.1 LED3.A
N$43  (1 unrouted)
N$44  (2 unrouted)
N$45
  Bottom 0.406: R36.1 LED4.A
N$46  (1 unrouted)
N$47  (2 unrouted)